# Altium schematic sheet Driver.SchDoc
size A
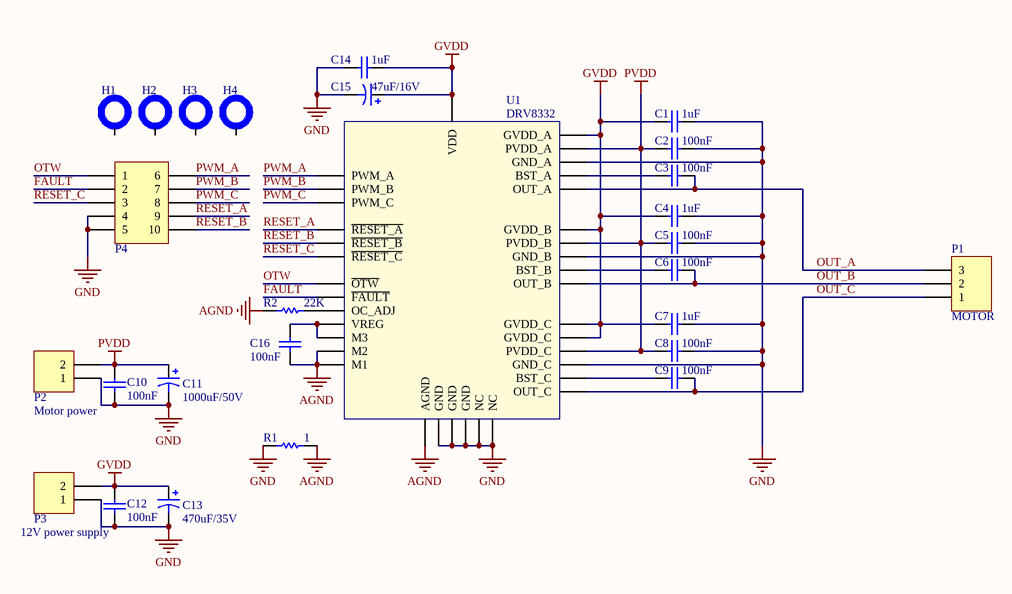
[diagram p0: Driver.SchDoc]

## Parts
C1  value 1uF  [C_0603]  (hidden comment: Cap)
C2  value 100nF  [C_0603]  (hidden comment: Cap)
C3  value 100nF  [C_0603]  (hidden comment: Cap)
C4  value 1uF  [C_0603]  (hidden comment: Cap)
C5  value 100nF  [C_0603]  (hidden comment: Cap)
C6  value 100nF  [C_0603]  (hidden comment: Cap)
C7  value 1uF  [C_0603]  (hidden comment: Cap)
C8  value 100nF  [C_0603]  (hidden comment: Cap)
C9  value 100nF  [C_0603]  (hidden comment: Cap)
C10  value 100nF  [C_0603]  (hidden comment: Cap)
C11  value 1000uF/50V  [CP2/6 lying]  (hidden comment: Cap Pol1)
C12  value 100nF  [C_0603]  (hidden comment: Cap)
C13  value 470uF/35V  [CAP ALU SIZE G]  (hidden comment: Cap Pol1)
C14  value 1uF  [C_0603]  (hidden comment: Cap)
C15  value 47uF/16V  [C_TANTALUM_C]  (hidden comment: Cap Pol1)
C16  value 100nF  [C_0603]  (hidden comment: Cap)
H1  3mm hole  [3mm HOLE]  (value not drawn)
H2  3mm hole  [3mm HOLE]  (value not drawn)
H3  3mm hole  [3mm HOLE]  (value not drawn)
H4  3mm hole  [3mm HOLE]  (value not drawn)
P1  MOTOR  [DOMINO 3-5mm]
P2  Motor power  [DOMINO 2- 5mm]
P3  12V power supply  [DOMINO 2- 5mm]
P4  Header 5X2  [JP5X2]  (value not drawn)
R1  value 1  [R_0603]  (hidden comment: Res1)
R2  value 22K  [R_0603]  (hidden comment: Res1)
U1  DRV8332  [HSSOP36_HEATSINK]

## Nets
AGND: C16.1 R1.2 R2.1 U1.9(AGND) U1.12(M2) U1.13(M1)
GND: C1.2 C2.2 C4.2 C5.2 C7.2 C8.2 C10.1 C11.2 C12.1 C13.2 C14.1 C15.2 P2.1 P3.1 P4.4 P4.5 R1.1 U1.8(GND) U1.23(GND_C) U1.24(GND) U1.25(GND) U1.26(NC) U1.27(NC) U1.31(GND_B) U1.32(GND_A)
GVDD: C1.1 C4.1 C7.1 C12.2 C13.1 C14.2 C15.1 P3.2 U1.1(GVDD_B) U1.17(VDD) U1.18(GVDD_C) U1.19(GVDD_C) U1.36(GVDD_A)
PVDD: C2.1 C5.1 C8.1 C10.2 C11.1 P2.2 U1.21(PVDD_C) U1.29(PVDD_B) U1.34(PVDD_A)
FAULT: P4.2 U1.3(~{FAULT})
OTW: P4.1 U1.2(~{OTW})
OUT_A: C3.2 P1.3 U1.33(OUT_A)
OUT_B: C6.2 P1.2 U1.30(OUT_B)
OUT_C: C9.2 P1.1 U1.22(OUT_C)
PWM_A: P4.6 U1.4(PWM_A)
PWM_B: P4.7 U1.6(PWM_B)
PWM_C: P4.8 U1.16(PWM_C)
RESET_A: P4.9 U1.5(~{RESET_A})
RESET_B: P4.10 U1.14(~{RESET_B})
RESET_C: P4.3 U1.15(~{RESET_C})
NetC3_1: C3.1 U1.35(BST_A)
NetC6_1: C6.1 U1.28(BST_B)
NetC9_1: C9.1 U1.20(BST_C)
NetC16_2: C16.2 U1.10(VREG) U1.11(M3)
NetR2_2: R2.2 U1.7(OC_ADJ)

Not connected (* = marked no-connect by the designer): H1 0(GND); H2 0(GND); H3 0(GND); H4 0(GND)

## Library data of the parts
C1-C10 C12 C14 C16 = Cap: Capacitor; Published: 8-Jun-2000; LatestRevisionDate: 17-Jul-2002; LatestRevisionNote: Re-released for DXP Platform.; PackageReference: RAD-0.3; Publisher: Altium Limited; PackageDescription: Radial Cap, Thru-Hole; 2 Leads; 0.3 in Pin Spacing
C11 C13 C15 = Cap Pol1: Polarized Capacitor (Radial); Published: 8-Jun-2000; LatestRevisionDate: 17-Jul-2002; LatestRevisionNote: Re-released for DXP Platform.; PackageReference: RB7.6-15; Publisher: Altium Limited; PackageDescription: Polarized Capacitor (Radial); 2 Leads
P1 = Header 3: Header, 3-Pin; LatestRevisionDate: 17-Jul-2002; LatestRevisionNote: Re-released for DXP Platform.; Publisher: Altium Limited
P2 P3 = Domino 2: Domino, 2-Pin; LatestRevisionDate: 17-Jul-2002; LatestRevisionNote: Re-released for DXP Platform.; Publisher: Altium Limited
P4 = Header 5X2: Header, 5-Pin, Dual row; LatestRevisionDate: 17-Jul-2002; LatestRevisionNote: Re-released for DXP Platform.; Publisher: Altium Limited
R1 R2 = Res1: Resistor; Published: 8-Jun-2000; LatestRevisionDate: 17-Jul-2002; LatestRevisionNote: Re-released for DXP Platform.; PackageReference: AXIAL-0.3; Publisher: Altium Limited; PackageDescription: Axial Device, Thru-Hole; 2 Leads; 0.3 in Pin Spacing
U1 = DRV8332: Three-Phase PWM Motor Driver